# EAGLE design vic-20-mem-board (EAGLE 8.3.1)
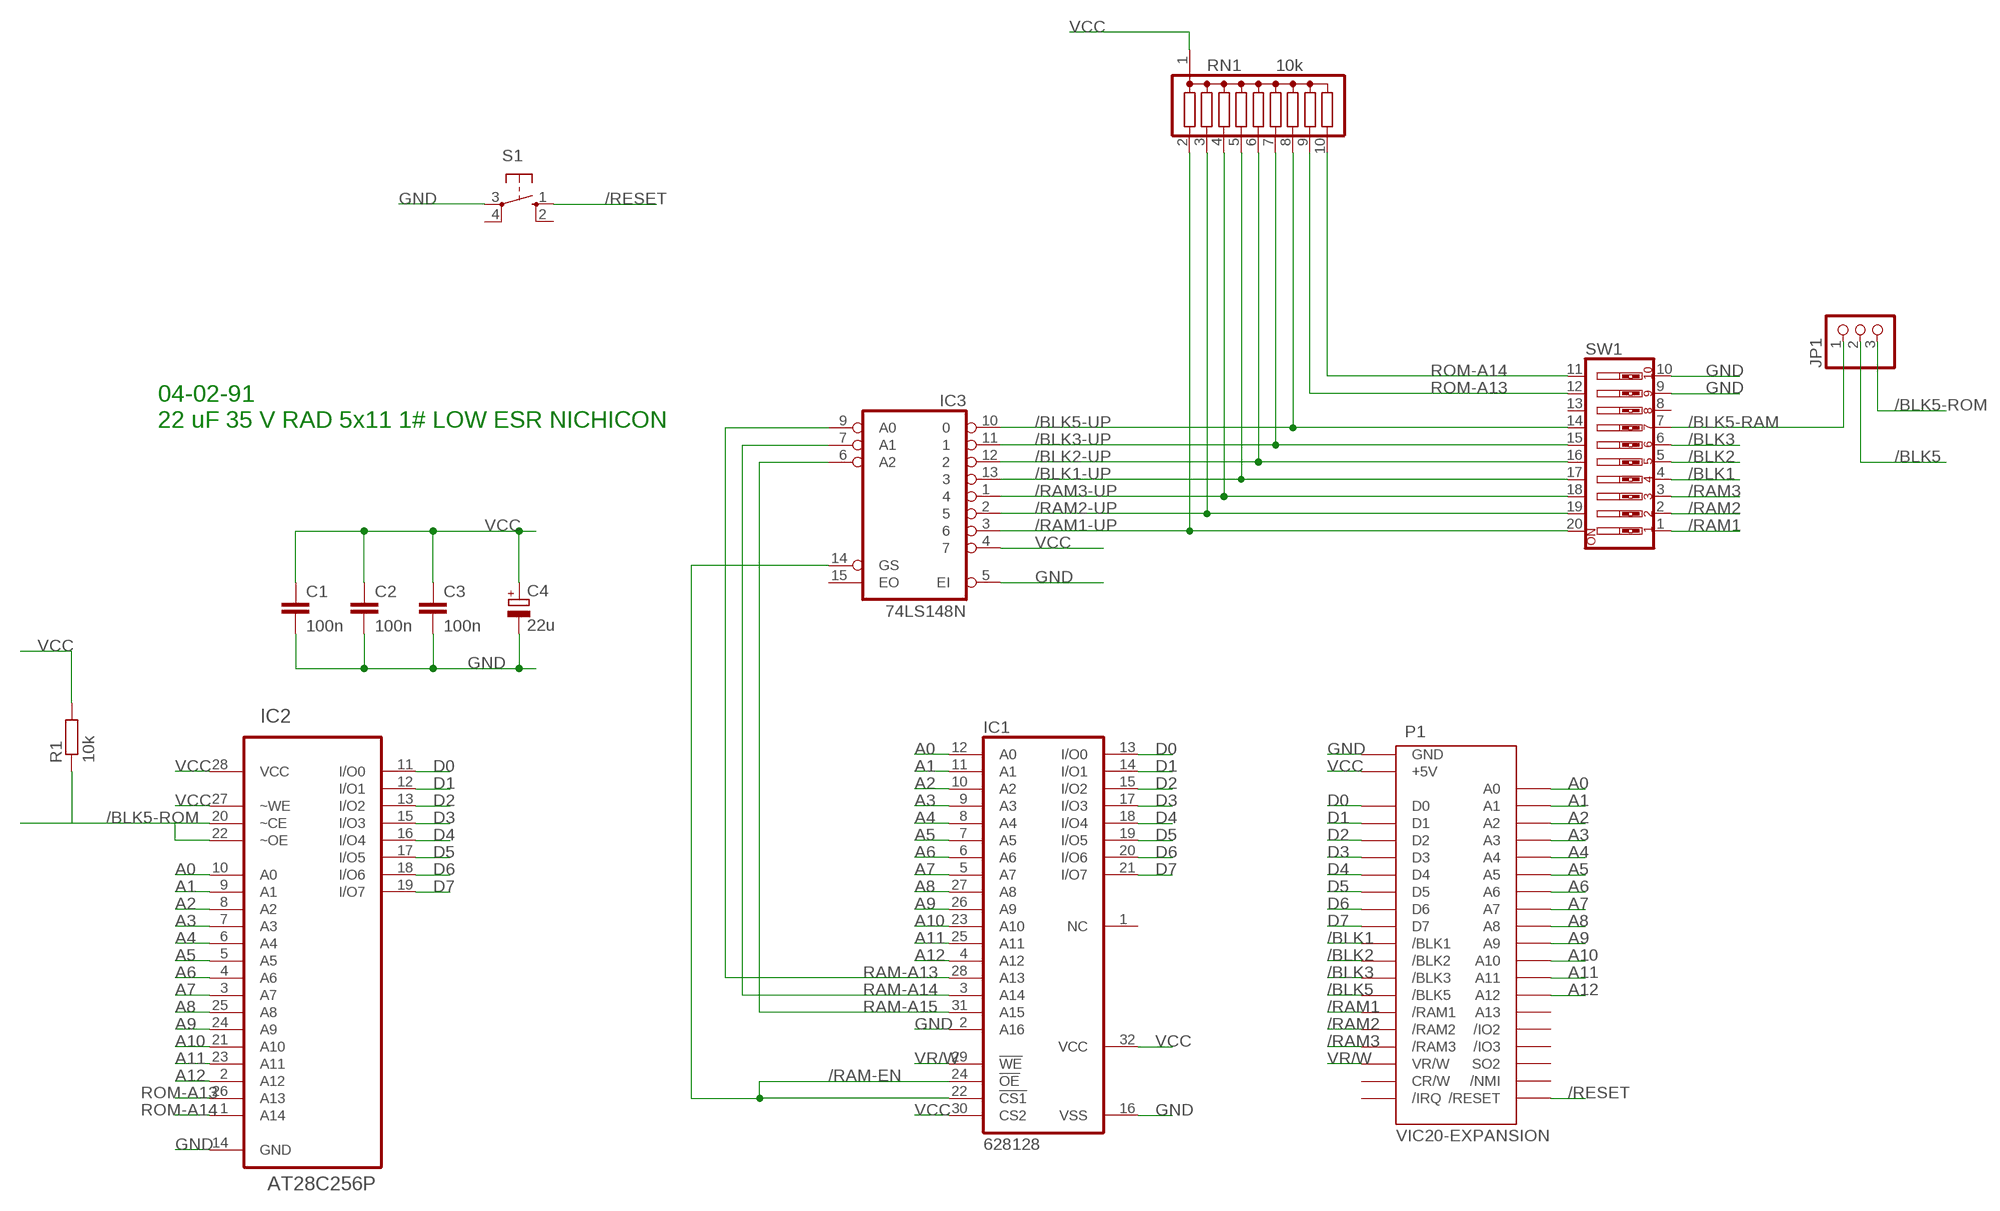
[diagram p0: schematic, sheet 1]

## Parts
C1  100n  C-EU025-025X050  [C025-025X050]
C2  100n  C-EU025-025X050  [C025-025X050]
C3  100n  C-EU025-025X050  [C025-025X050]
C4  22u  CPOL-EUE2.5-5  [E2,5-5]
IC1  628128  628128P  [DIL32]
IC2  AT28C256P  [DIL28-6]
IC3  74LS148N  [DIL16]
JP1  PINHD-1X3  [1X03]
P1  VIC20-EXPANSION  [44PINEDGE]
R1  10k  R-EU_0204/7  [0204/7]
RN1  10k  G09R  [SIL10]
S1  10-XX  [B3F-10XX]
SW1  SW_DIP-10  [EDG-10]

## Nets
/BLK1: P1.10(/BLK1) SW1.4
/BLK1-UP: IC3.13 RN1.5 SW1.17
/BLK2: P1.11(/BLK2) SW1.5
/BLK2-UP: IC3.12 RN1.6 SW1.16
/BLK3: P1.12(/BLK3) SW1.6
/BLK3-UP: IC3.11 RN1.7 SW1.15
/BLK5: JP1.2 P1.13(/BLK5)
/BLK5-RAM: JP1.1 SW1.7
/BLK5-ROM: IC2.20(~CE) IC2.22(~OE) JP1.3 R1.1
/BLK5-UP: IC3.10 RN1.8 SW1.14
/RAM1: P1.14(/RAM1) SW1.1
/RAM1-UP: IC3.3 RN1.2 SW1.20
/RAM2: P1.15(/RAM2) SW1.2
/RAM2-UP: IC3.2 RN1.3 SW1.19
/RAM3: P1.16(/RAM3) SW1.3
/RAM3-UP: IC3.1 RN1.4 SW1.18
/RAM-EN: IC1.22(!CS1) IC1.24(!OE) IC3.14(GS)
/RESET: P1.X(/RESET) S1.1(S)
A0: IC1.12(A0) IC2.10(A0) P1.B(A0)
A1: IC1.11(A1) IC2.9(A1) P1.C(A1)
A2: IC1.10(A2) IC2.8(A2) P1.D(A2)
A3: IC1.9(A3) IC2.7(A3) P1.E(A3)
A4: IC1.8(A4) IC2.6(A4) P1.F(A4)
A5: IC1.7(A5) IC2.5(A5) P1.H(A5)
A6: IC1.6(A6) IC2.4(A6) P1.J(A6)
A7: IC1.5(A7) IC2.3(A7) P1.K(A7)
A8: IC1.27(A8) IC2.25(A8) P1.L(A8)
A9: IC1.26(A9) IC2.24(A9) P1.M(A9)
A10: IC1.23(A10) IC2.21(A10) P1.N(A10)
A11: IC1.25(A11) IC2.23(A11) P1.P(A11)
A12: IC1.4(A12) IC2.2(A12) P1.R(A12)
D0: IC1.13(I/O0) IC2.11(I/O0) P1.2(D0)
D1: IC1.14(I/O1) IC2.12(I/O1) P1.3(D1)
D2: IC1.15(I/O2) IC2.13(I/O2) P1.4(D2)
D3: IC1.17(I/O3) IC2.15(I/O3) P1.5(D3)
D4: IC1.18(I/O4) IC2.16(I/O4) P1.6(D4)
D5: IC1.19(I/O5) IC2.17(I/O5) P1.7(D5)
D6: IC1.20(I/O6) IC2.18(I/O6) P1.8(D6)
D7: IC1.21(I/O7) IC2.19(I/O7) P1.9(D7)
GND [pwr]: C1.2 C2.2 C3.2 C4.- IC1.2(A16) IC1.16(VSS) IC2.14(GND) IC3.5(EI) P1.1(GND) P1.22(GND) P1.A(GND) P1.Z(GND) S1.3(P) SW1.9 SW1.10
RAM-A13: IC1.28(A13) IC3.9(A0)
RAM-A14: IC1.3(A14) IC3.7(A1)
RAM-A15: IC1.31(A15) IC3.6(A2)
ROM-A13: IC2.26(A13) RN1.9 SW1.12
ROM-A14: IC2.1(A14) RN1.10 SW1.11
VCC [pwr]: C1.1 C2.1 C3.1 C4.+ IC1.30(CS2) IC1.32(VCC) IC2.27(~WE) IC2.28(VCC) IC3.4 P1.21(+5V) R1.2 RN1.1
VR/W: IC1.29(!WE) P1.17(VR/W)
Unconnected: IC1.1(NC) IC3.15(EO) P1.18(CR/W) P1.19(/IRQ) P1.S(A13) P1.T(/IO2) P1.U(/IO3) P1.V(SO2) P1.W(/NMI) S1.2(S1) S1.4(P1) SW1.8 SW1.13

## Notes on the sheet
- 04-02-91
  22 uF 35 V RAD 5x11 1# LOW ESR NICHICON

## Power pins joined to a net without a drawn wire
GND: IC3.8(GND)
VCC: IC3.16(VCC)

## Library data of the parts
C1-C3 = resistor:C-EU: CAPACITOR, European symbol
C4 = rcl:CPOL-EU: POLARIZED CAPACITOR, European symbol
IC1 = memory-hitachi:628128P: MEMORY; OC_FARNELL: unknown; OC_NEWARK: unknown
IC2 = AT28C256:AT28C256P
IC3 = 74xx-eu:74*148: 10-line to 4-line and 8-line to 3-line PRIORITY ENCODER
JP1 = pinhead:PINHD-1X3: PIN HEADER
P1 = VIC20-expansion:VIC20-EXPANSION: 44 PIN EDGE CONNECTOR FOR PCB
R1 = resistor:R-EU_: RESISTOR, European symbol
RN1 = resistor-sil:G09R: SIL RESISTOR; OC_FARNELL: unknown; OC_NEWARK: unknown
S1 = switch-omron:10-XX: OMRON SWITCH; MPN: B3F-1000; OC_FARNELL: 176432; OC_NEWARK: 36M3542
SW1 = special:SW_DIP-10: DIP SWITCH

## Net classes
0 default: width 0.254 mm
1 pwr: width 0.508 mm, clearance 0.508 mm

## Board
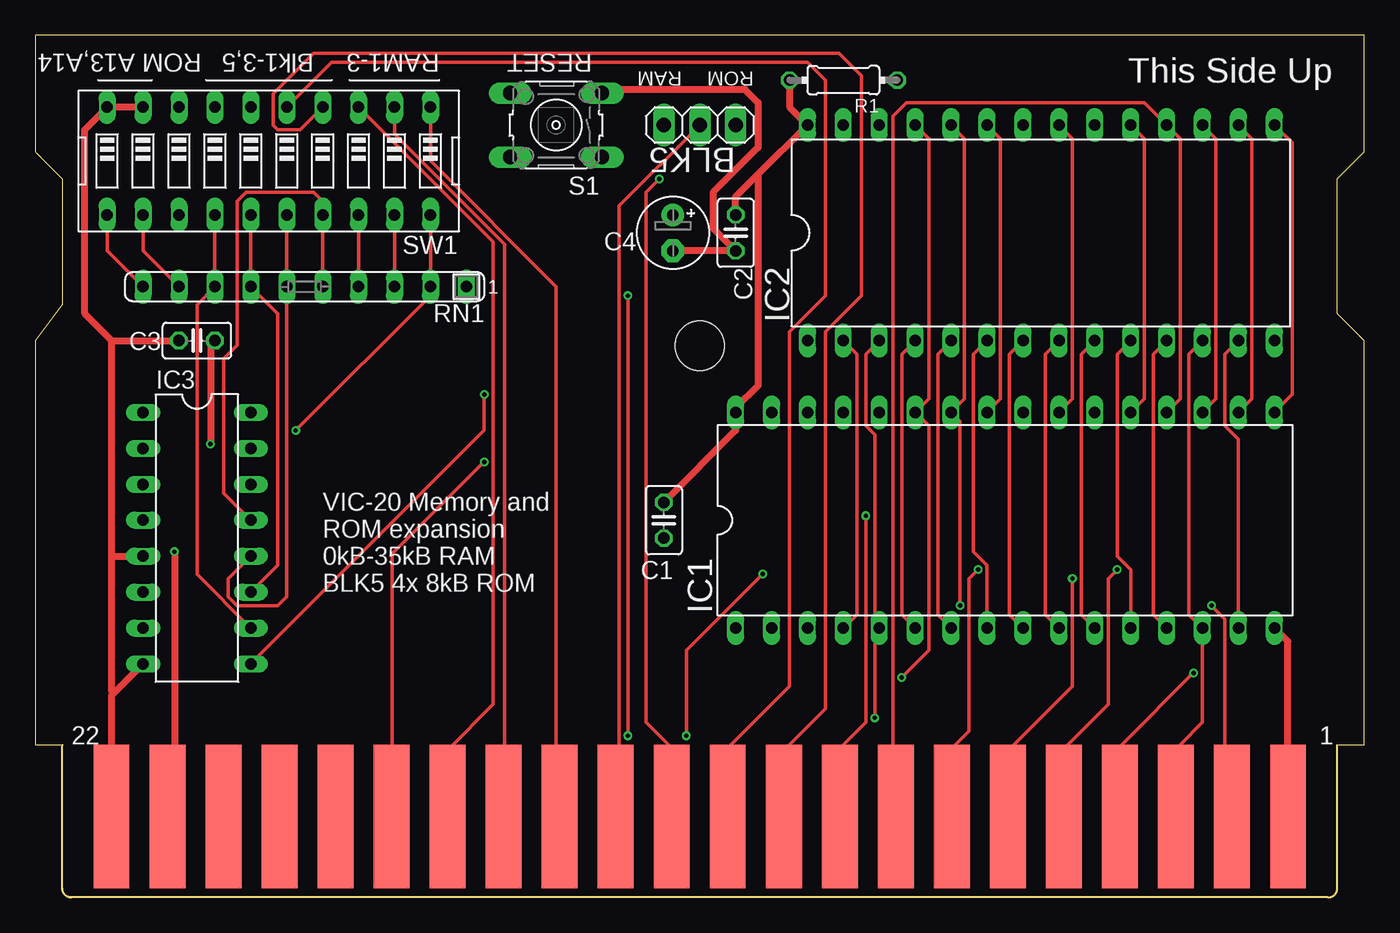
[diagram p1: board, top side]
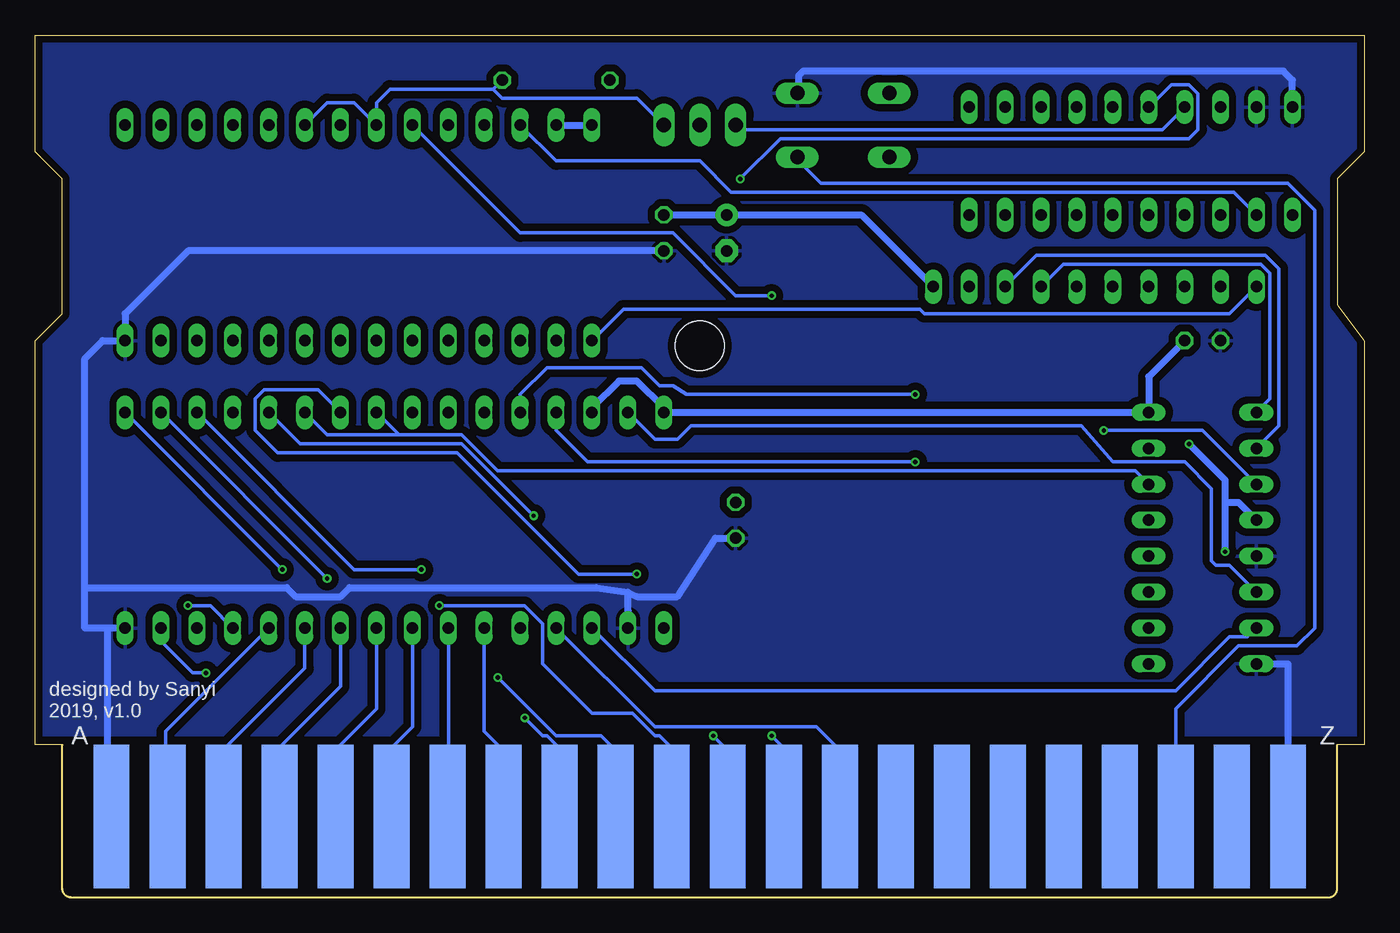
[diagram p2: board, bottom side, seen from below]

Size 93.98 x 60.95 mm. Coordinates in mm from the lower left corner, seen from the top.
Outline: 92.08,8.13 92.08,0.64 arc-90 91.44,0 2.54,0 arc-90 1.91,0.64 1.91,10.79 0,10.79 0,39.37 1.91,41.91 1.91,50.8 0,52.7 0,60.95 93.98,60.95 93.98,52.7 92.08,50.8 92.08,41.27 93.98,39.37 93.98,10.79 92.08,10.79
Copper layers (1*16): Top 0.035mm / dielectric 1.6mm / Bottom 0.035mm
Design rules "Elecrow_2-layer_PCB_eagle_rule": minimum track width 6mil, minimum drill 12mil, track to track 6mil, track to pad 6mil, pad to pad 6mil, via to via 8mil, smd to smd 0mil, copper to edge 20mil, drill to drill 10mil, minimum pad ring 6mil, minimum via ring 6mil, stop-mask expansion 0mil, vias tented up to drill 100mil, thermal gap 10mil
Holes 3.5 mm at 46.99,39

### Footprints (pad centres in the part's own frame; a part is rotated, then mirrored left to right if it is on the bottom)
C025-025X050 = drill 0.813 octagon: 1 -1.27,0; 2 1.27,0
E2,5-5 = drill 0.813 pad 1.6: + -1.27,0 | drill 0.813 pad 1.6 octagon: - 1.27,0
DIL32 = drill 0.813 long: 1 -19.05,-7.62; 2 -16.51,-7.62; 3 -13.97,-7.62; 4 -11.43,-7.62; 5 -8.89,-7.62; 6 -6.35,-7.62; 7 -3.81,-7.62; 8 -1.27,-7.62; 9 1.27,-7.62; 10 3.81,-7.62; 11 6.35,-7.62; 12 8.89,-7.62; 13 11.43,-7.62; 14 13.97,-7.62; 15 16.51,-7.62; 16 19.05,-7.62; 17 19.05,7.62; 18 16.51,7.62; 19 13.97,7.62; 20 11.43,7.62; 21 8.89,7.62; 22 6.35,7.62; 23 3.81,7.62; 24 1.27,7.62; 25 -1.27,7.62; 26 -3.81,7.62; 27 -6.35,7.62; 28 -8.89,7.62; 29 -11.43,7.62; 30 -13.97,7.62; 31 -16.51,7.62; 32 -19.05,7.62
DIL28-6 = drill 0.813 long: 1 -16.51,-7.62; 2 -13.97,-7.62; 3 -11.43,-7.62; 4 -8.89,-7.62; 5 -6.35,-7.62; 6 -3.81,-7.62; 7 -1.27,-7.62; 8 1.27,-7.62; 9 3.81,-7.62; 10 6.35,-7.62; 11 8.89,-7.62; 12 11.43,-7.62; 13 13.97,-7.62; 14 16.51,-7.62; 15 16.51,7.62; 16 13.97,7.62; 17 11.43,7.62; 18 8.89,7.62; 19 6.35,7.62; 20 3.81,7.62; 21 1.27,7.62; 22 -1.27,7.62; 23 -3.81,7.62; 24 -6.35,7.62; 25 -8.89,7.62; 26 -11.43,7.62; 27 -13.97,7.62; 28 -16.51,7.62
DIL16 = drill 0.813 long: 1 -8.89,-3.81; 2 -6.35,-3.81; 3 -3.81,-3.81; 4 -1.27,-3.81; 5 1.27,-3.81; 6 3.81,-3.81; 7 6.35,-3.81; 8 8.89,-3.81; 9 8.89,3.81; 10 6.35,3.81; 11 3.81,3.81; 12 1.27,3.81; 13 -1.27,3.81; 14 -3.81,3.81; 15 -6.35,3.81; 16 -8.89,3.81
1X03 = drill 1.016 long: 1 -2.54,0; 2 0,0; 3 2.54,0
44PINEDGE = smd 2.54 x 10.16: 1 41.605,5.715; 2 37.643,5.715; 3 33.68,5.715; 4 29.718,5.715; 5 25.756,5.715; 6 21.793,5.715; 7 17.831,5.715; 8 13.868,5.715; 9 9.906,5.715; 10 5.944,5.715; 11 1.981,5.715; 12 -1.981,5.715; 13 -5.944,5.715; 14 -9.906,5.715; 15 -13.868,5.715; 16 -17.831,5.715; 17 -21.793,5.715; 18 -25.756,5.715; 19 -29.718,5.715; 20 -33.68,5.715; 21 -37.643,5.715; 22 -41.605,5.715 | smd 2.54 x 10.16 bottom: A 41.605,5.715; B 37.643,5.715; C 33.68,5.715; D 29.718,5.715; E 25.756,5.715; F 21.793,5.715; H 17.831,5.715; J 13.868,5.715; K 9.906,5.715; L 5.944,5.715; M 1.981,5.715; N -1.981,5.715; P -5.944,5.715; R -9.906,5.715; S -13.868,5.715; T -17.831,5.715; U -21.793,5.715; V -25.756,5.715; W -29.718,5.715; X -33.68,5.715; Y -37.643,5.715; Z -41.605,5.715
0204/7 = drill 0.813 octagon: 1 -3.81,0; 2 3.81,0
SIL10 = drill 0.813 long: 1 -11.43,0; 2 -8.89,0; 3 -6.35,0; 4 -3.81,0; 5 -1.27,0; 6 1.27,0; 7 3.81,0; 8 6.35,0; 9 8.89,0; 10 11.43,0
B3F-10XX = drill 1.016 long: 1 -3.251,2.261; 2 3.251,2.261; 3 -3.251,-2.261; 4 3.251,-2.261
EDG-10 = drill 0.813 long: 1 -11.43,-3.81; 2 -8.89,-3.81; 3 -6.35,-3.81; 4 -3.81,-3.81; 5 -1.27,-3.81; 6 1.27,-3.81; 7 3.81,-3.81; 8 6.35,-3.81; 9 8.89,-3.81; 10 11.43,-3.81; 11 11.43,3.81; 12 8.89,3.81; 13 6.35,3.81; 14 3.81,3.81; 15 1.27,3.81; 16 -1.27,3.81; 17 -3.81,3.81; 18 -6.35,3.81; 19 -8.89,3.81; 20 -11.43,3.81

### Placement (x,y rotation side)
C1  44.45,26.67 270 top
C2  49.53,46.99 270 top
C3  11.43,39.37 180 top
C4  45.09,46.99 270 top
IC1  68.58,26.67 0 top
IC2  71.12,46.99 0 top
IC3  11.43,25.4 270 top
JP1  46.99,54.61 0 top
P1  46.99,0 0 top
R1  57.15,57.78 180 top
RN1  19.05,43.18 180 top
S1  36.83,54.61 180 top
SW1  16.51,52.07 180 top

### Tracks (layer width: path | path; a pad name or v marks a point on that pad's centre or on a via)
/BLK1
  Top 0.254: SW1.4 18.73,54.29 17.14,54.29 16.83,54.61 16.83,56.83 19.68,59.69 56.83,59.69 58.42,58.1 58.42,42.55 55.88,40.01 55.88,13.34 53.02,10.48 53.02,5.71 P1.10
/BLK1-UP
  Top 0.254: IC3.13 13.34,28.57 13.34,38.1 14.29,39.05 14.29,49.21 14.92,49.85 19.68,49.85 20.32,49.21 SW1.17 RN1.5
/BLK2
  Top 0.254: SW1.5 20.95,59.05 54.61,59.05 55.88,57.78 55.88,42.55 53.34,40.01 53.34,14.92 49.21,10.79 49.21,5.71 P1.11
/BLK2-UP
  Top 0.254: IC3.12 13.65,22.54 13.65,21.27 14.29,20.64 17.14,20.64 17.78,21.27 RN1.6 SW1.16
/BLK3  (via drill 0.3)
  Top 0.254: v44.13,50.8 43.18,49.85 43.18,12.38 44.77,10.79 44.77,5.71 P1.12
  Bottom 0.254: SW1.6 13.65,57.47 12.38,57.47 11.75,56.83 11.75,54.29 12.38,53.66 41.27,53.66 v44.13,50.8
/BLK3-UP
  Top 0.254: IC3.11 17.14,23.5 17.14,41.27 RN1.7 SW1.15
/BLK5
  Top 0.254: JP1.2 41.27,48.9 41.27,5.71 P1.13
/BLK5-RAM
  Bottom 0.254: SW1.7 14.29,54.29 44.13,54.29 JP1.1
/BLK5-ROM
  Bottom 0.254: IC2.20 73.34,56.2 71.44,56.2 IC2.22 69.85,56.2 68.9,57.15 61.59,57.15 | JP1.3 51.44,56.52 60.96,56.52 61.59,57.15 | R1.1 61.59,57.15
/BLK5-UP
  Top 0.254: SW1.14 RN1.8 11.43,41.91 11.43,22.86 IC3.10
/RAM1
  Top 0.254: SW1.1 27.94,52.07 36.83,43.18 36.83,5.71 P1.14
/RAM1-UP  (via drill 0.3)
  Top 0.254: v18.41,33.02 27.94,42.55 RN1.2 SW1.20
  Bottom 0.254: IC3.3 11.43,33.02 v18.41,33.02
/RAM2
  Top 0.254: SW1.2 25.4,53.98 33.18,46.2 33.18,5.56 P1.15
/RAM2-UP
  Top 0.254: RN1.3 SW1.19
  Bottom 0.254: IC3.2 6.03,33.34 6.03,44.45 6.99,45.4 23.18,45.4 RN1.3
/RAM3
  Top 0.254: SW1.3 32.38,46.35 32.38,13.65 29.21,10.48 29.21,5.71 P1.16
/RAM3-UP
  Top 0.254: RN1.4 SW1.18
  Bottom 0.254: IC3.1 6.67,35.24 6.67,44.13 7.3,44.77 21.27,44.77 RN1.4
/RAM-EN
  Bottom 0.254: IC3.14 16.19,30.16 61.28,30.16 63.82,32.7 68.26,32.7 | IC1.24 68.26,32.7 | IC1.22 73.34,32.7 68.26,32.7
/RESET
  Bottom 0.254: S1.1 40.01,52.07 38.42,50.48 5.4,50.48 3.49,48.58 3.49,19.05 4.76,17.78 8.89,17.78 13.34,13.34 13.34,9.84 13.02,5.71 P1.X
A0
  Top 0.254: IC2.10 76.52,38.42 76.52,24.13 77.47,23.18 IC1.12
  Bottom 0.254: IC1.12 84.77,11.75 84.77,9.05 84.45,5.71 P1.B
A1
  Top 0.254: IC1.11 73.98,20 73.98,38.42 IC2.9
  Bottom 0.254: IC1.11 74.93,16.19 80.64,10.48 80.64,5.71 P1.C
A2
  Top 0.254: IC2.8 71.44,38.42 71.44,20 IC1.10
  Bottom 0.254: IC1.10 72.39,14.92 76.52,10.79 76.52,5.71 P1.D
A3
  Top 0.254: IC2.7 68.9,38.42 68.9,20 IC1.9
  Bottom 0.254: IC1.9 69.85,13.34 72.71,10.48 72.71,5.71 P1.E
A4
  Top 0.254: IC2.6 66.36,38.42 66.36,24.45 67.31,23.5 IC1.8
  Bottom 0.254: IC1.8 67.31,12.06 68.58,10.79 68.58,5.71 P1.F
A5
  Top 0.254: IC2.5 63.82,38.42 63.82,20 IC1.7
  Bottom 0.254: IC1.7 64.77,5.71 P1.H
A6
  Top 0.254: IC2.4 61.28,38.42 61.28,20 IC1.6
  Bottom 0.254: IC1.6 62.23,11.75 60.96,10.48 60.96,5.71 P1.J
A7  (via drill 0.3)
  Top 0.254: IC2.3 58.74,38.42 58.74,33.34 59.37,32.7 59.37,19.37 IC1.5 59.37,18.73 v59.37,12.7
  Bottom 0.254: v59.37,12.7 58.1,11.43 57.78,11.43 57.15,10.79 57.15,5.71 P1.K
A8  (via drill 0.3)
  Top 0.254: IC2.25 63.18,53.66 63.18,35.24 IC1.27 63.18,33.34 63.18,17.46 v61.28,15.56
  Bottom 0.254: v61.28,15.56 57.15,11.43 53.98,11.43 53.02,10.48 53.02,5.71 P1.L
A9  (via drill 0.3)
  Top 0.254: IC2.24 65.72,53.66 65.72,35.24 IC1.26 65.41,33.66 v65.41,20.64
  Bottom 0.254: v65.41,20.64 59.37,20.64 58.1,19.37 58.1,16.51 54.61,13.02 51.75,13.02 50.16,11.43 49.85,11.43 49.21,10.79 49.21,5.71 P1.M
A10  (via drill 0.3)
  Top 0.254: IC1.23 73.34,35.24 73.34,53.66 IC2.21 | v51.44,22.86 46.04,17.46 v46.04,11.43
  Bottom 0.254: IC1.23 73.98,35.88 77.79,35.88 78.42,35.24 78.42,33.02 76.83,31.43 64.14,31.43 55.56,22.86 v51.44,22.86 | v46.04,11.43 45.09,10.48 45.09,5.71 P1.N
A11  (via drill 0.3)
  Top 0.254: IC1.25 68.26,35.24 68.26,53.66 IC2.23 | v41.91,11.43 v41.91,42.55
  Bottom 0.254: IC2.23 59.69,46.99 48.9,46.99 44.45,42.55 v41.91,42.55 | v41.91,11.43 41.27,10.79 41.27,5.71 P1.P
A12
  Top 0.254: IC1.4 58.1,20 58.1,38.42 IC2.2
  Bottom 0.254: IC1.4 50.16,12.06 38.73,12.06 37.15,10.48 37.15,5.71 P1.R
D0  (via drill 0.3)
  Top 0.254: IC1.13 79.06,20 79.06,38.42 IC2.11 | v83.19,20.64 84.14,19.68 84.14,6.03 84.45,5.71 P1.2
  Bottom 0.254: IC1.13 81.6,20.64 v83.19,20.64
D1
  Top 0.254: P1.3 80.96,5.71 80.96,10.79 82.55,12.38 IC1.14 81.6,20 81.6,38.42 IC2.12
D2  (via drill 0.3)
  Top 0.254: IC1.15 85.09,32.38 84.14,33.34 84.14,38.42 IC2.13 | v81.92,15.88 76.83,10.79 76.83,5.71 P1.4
  Bottom 0.254: v81.92,15.88 82.87,15.88 85.09,18.1 IC1.15
D3  (via drill 0.3)
  Top 0.254: IC1.17 88.9,35.56 88.9,53.34 IC2.15 | v76.52,23.18 75.88,22.54 75.88,13.65 73.03,10.79 73.03,5.71 P1.5
  Bottom 0.254: v76.52,23.18 IC1.17
D4  (via drill 0.3)
  Top 0.254: IC1.18 86.04,35.24 86.04,53.66 IC2.16 | v73.34,22.54 73.34,14.92 68.9,10.48 68.9,5.71 P1.6
  Bottom 0.254: v73.34,22.54 IC1.18
D5  (via drill 0.3)
  Top 0.254: IC1.19 83.5,35.24 83.5,53.66 IC2.17 | v66.67,23.18 66.04,22.54 66.04,11.75 65.09,10.79 65.09,5.71 P1.7
  Bottom 0.254: IC1.19 71.44,23.18 v66.67,23.18
D6
  Top 0.254: IC1.20 80.96,35.24 80.96,53.66 IC2.18 78.42,56.2 61.59,56.2 60.64,55.24 60.64,5.71 P1.8
D7  (via drill 0.3)
  Top 0.254: IC1.21 78.42,35.24 78.42,53.66 IC2.19 | v58.74,26.99 58.74,12.38 57.15,10.79 57.15,5.71 P1.9
  Bottom 0.254: IC1.21 75.25,32.07 63.82,32.07 v58.74,26.99
GND
  Top 0.508: IC1.16 88.58,18.1 88.58,5.71 P1.A | S1.3 40.32,57.15 50.16,57.15 51.12,56.2 51.12,53.02 47.94,49.85 47.94,47.31 C2.2 C4.- | SW1.9 SW1.10 3.49,54.29 3.49,41.27 5.4,39.37 | 5.56,14.45 5.4,14.29 5.4,5.71 P1.Z | 5.56,14.45 IC3.8 | 5.4,24.13 IC3.5 | 5.4,24.13 5.4,14.61 5.56,14.45 | 5.4,39.37 C3.2 | 5.4,24.13 5.4,39.37
  Bottom 0.508: C1.2 45.88,25.4 48.58,21.27 51.44,21.27 52.07,21.59 | 52.07,21.59 IC1.2 52.07,20.32 | 90.49,21.91 90.49,19.05 88.9,19.05 | 90.49,21.91 90.49,38.1 89.22,39.37 IC2.14 87.63,41.27 83.19,45.72 C2.2 | IC1.16 88.9,19.05 | 52.07,21.59 54.29,21.91 71.75,21.91 72.39,21.27 75.56,21.27 76.2,21.91 90.49,21.91 | 88.9,19.05 88.9,5.71 P1.A | SW1.10 5.08,57.78 5.71,58.42 39.69,58.42 40.01,58.1 40.01,57.15 S1.3 | IC3.8 5.4,16.51 5.4,5.71 P1.Z
  pour Bottom: -1.27,62.23 -1.27,11.43 95.25,11.43 95.25,62.23 0,62.23
RAM-A13  (via drill 0.3)
  Top 0.254: IC3.9 31.75,33.02 v31.75,35.56
  Bottom 0.254: v31.75,35.56 47.94,35.56 48.9,36.2 49.85,36.2 51.12,37.47 56.52,37.47 57.78,37.47 59.69,35.56 IC1.28
RAM-A14
  Bottom 0.254: IC3.7 8.26,18.41 9.53,18.41 13.34,14.61 50.16,14.61 IC1.3
RAM-A15
  Bottom 0.254: IC3.6 9.53,23.5 10.48,23.5 10.79,23.81 10.79,28.89 12.7,30.8 17.78,30.8 20,33.34 47.62,33.34 48.58,32.38 50.16,32.38 IC1.31
ROM-A13
  Top 0.254: RN1.9 7.62,45.72 SW1.12
  Bottom 0.254: IC2.26 57.15,52.07 46.99,52.07 44.77,49.85 9.21,49.85 SW1.12
ROM-A14
  Top 0.254: RN1.10 5.08,45.72 SW1.11
  Bottom 0.254: IC2.1 52.39,41.59 31.43,41.59 31.11,41.27 9.53,41.27 RN1.10
VCC  (via drill 0.3)
  Top 0.508: v12.38,32.07 12.38,39.05 C3.1 | C1.1 49.53,33.02 IC1.32 49.53,34.61 51.12,36.2 51.12,51.12 | 51.12,51.12 49.53,49.53 C2.1 | 51.12,51.12 IC2.28 53.34,55.88 R1.2 | v9.84,24.45 9.84,6.03 9.53,5.71 P1.21
  Bottom 0.508: IC3.4 8.89,27.94 9.84,27.94 | v12.38,32.07 9.84,29.53 9.84,27.94 | C3.1 15.24,36.83 IC3.16 IC1.32 49.53,34.61 51.44,36.51 52.7,36.51 54.61,34.61 IC1.30 | IC2.27 IC2.28 | RN1.1 35.56,48.26 C4.+ C2.1 | 9.84,27.94 v9.84,24.45
VR/W  (via drill 0.3)
  Top 0.254: v31.75,30.8 25.24,24.29 25.24,8.26 25.4,8.57 25.4,5.71 P1.17
  Bottom 0.254: IC1.29 57.15,33.02 54.93,30.8 v31.75,30.8

### Text on the board
tPlace: ROM A13,A14 | Blk1-3,5 | RAM1-3 | RESET | This Side Up | RAM | ROM | BLK5 | VIC-20 Memory and / ROM expansion / 0kB-35kB RAM / BLK5 4x 8kB ROM
bPlace: designed by Sanyi / 2019, v1.0